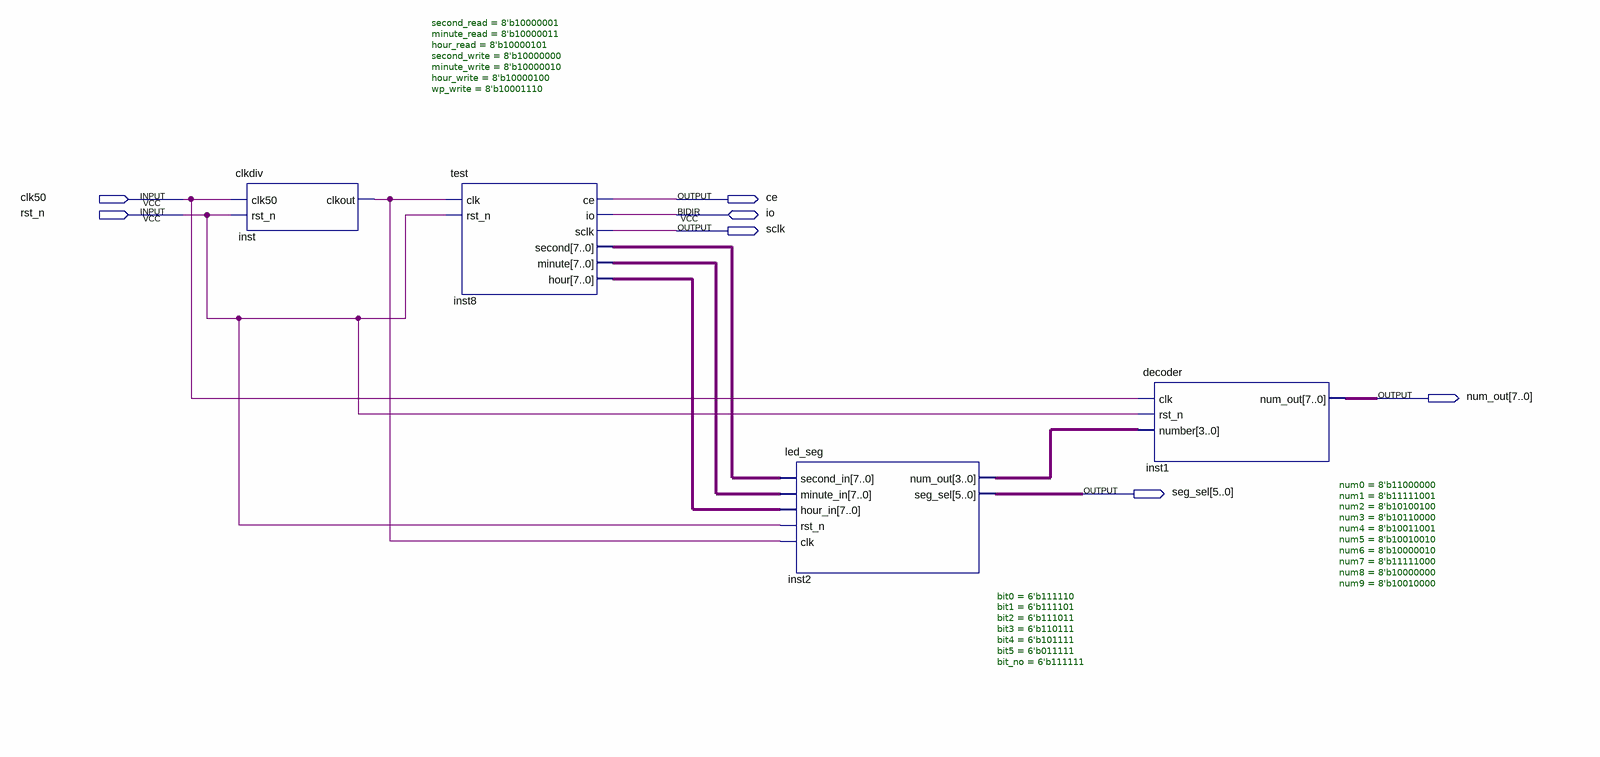
[diagram p0: schematic sheet]
// Quartus schematic top_level.bdf as structural Verilog: 4 symbols, 7 pins
module top_level (
  input  clk50,
  input  rst_n,
  inout  io,
  output ce,
  output sclk,
  output [7:0] num_out,
  output [5:0] seg_sel
);

  wire inst_clkout;
  wire [3:0] inst2_num_out;
  wire [7:0] inst8_hour, inst8_minute, inst8_second;

  clkdiv inst (.clk50(clk50), .rst_n(rst_n), .clkout(inst_clkout));
  test #(.second_read(8'b10000001), .minute_read(8'b10000011), .hour_read(8'b10000101), .second_write(8'b10000000), .minute_write(8'b10000010), .hour_write(8'b10000100), .wp_write(8'b10001110)) inst8 (
    .clk(inst_clkout), .rst_n(rst_n), .ce(ce), .io(io), .sclk(sclk), .second(inst8_second),
    .minute(inst8_minute), .hour(inst8_hour));
  led_seg #(.bit0(6'b111110), .bit1(6'b111101), .bit2(6'b111011), .bit3(6'b110111), .bit4(6'b101111), .bit5(6'b011111), .bit_no(6'b111111)) inst2 (
    .second_in(inst8_second), .minute_in(inst8_minute), .hour_in(inst8_hour), .rst_n(rst_n),
    .clk(inst_clkout), .num_out(inst2_num_out), .seg_sel(seg_sel));
  decoder #(.num0(8'b11000000), .num1(8'b11111001), .num2(8'b10100100), .num3(8'b10110000), .num4(8'b10011001), .num5(8'b10010010), .num6(8'b10000010), .num7(8'b11111000), .num8(8'b10000000), .num9(8'b10010000)) inst1 (
    .clk(clk50), .rst_n(rst_n), .number(inst2_num_out), .num_out(num_out));
endmodule
